# Altium schematic sheet User Control-Sliders.SchDoc
size C
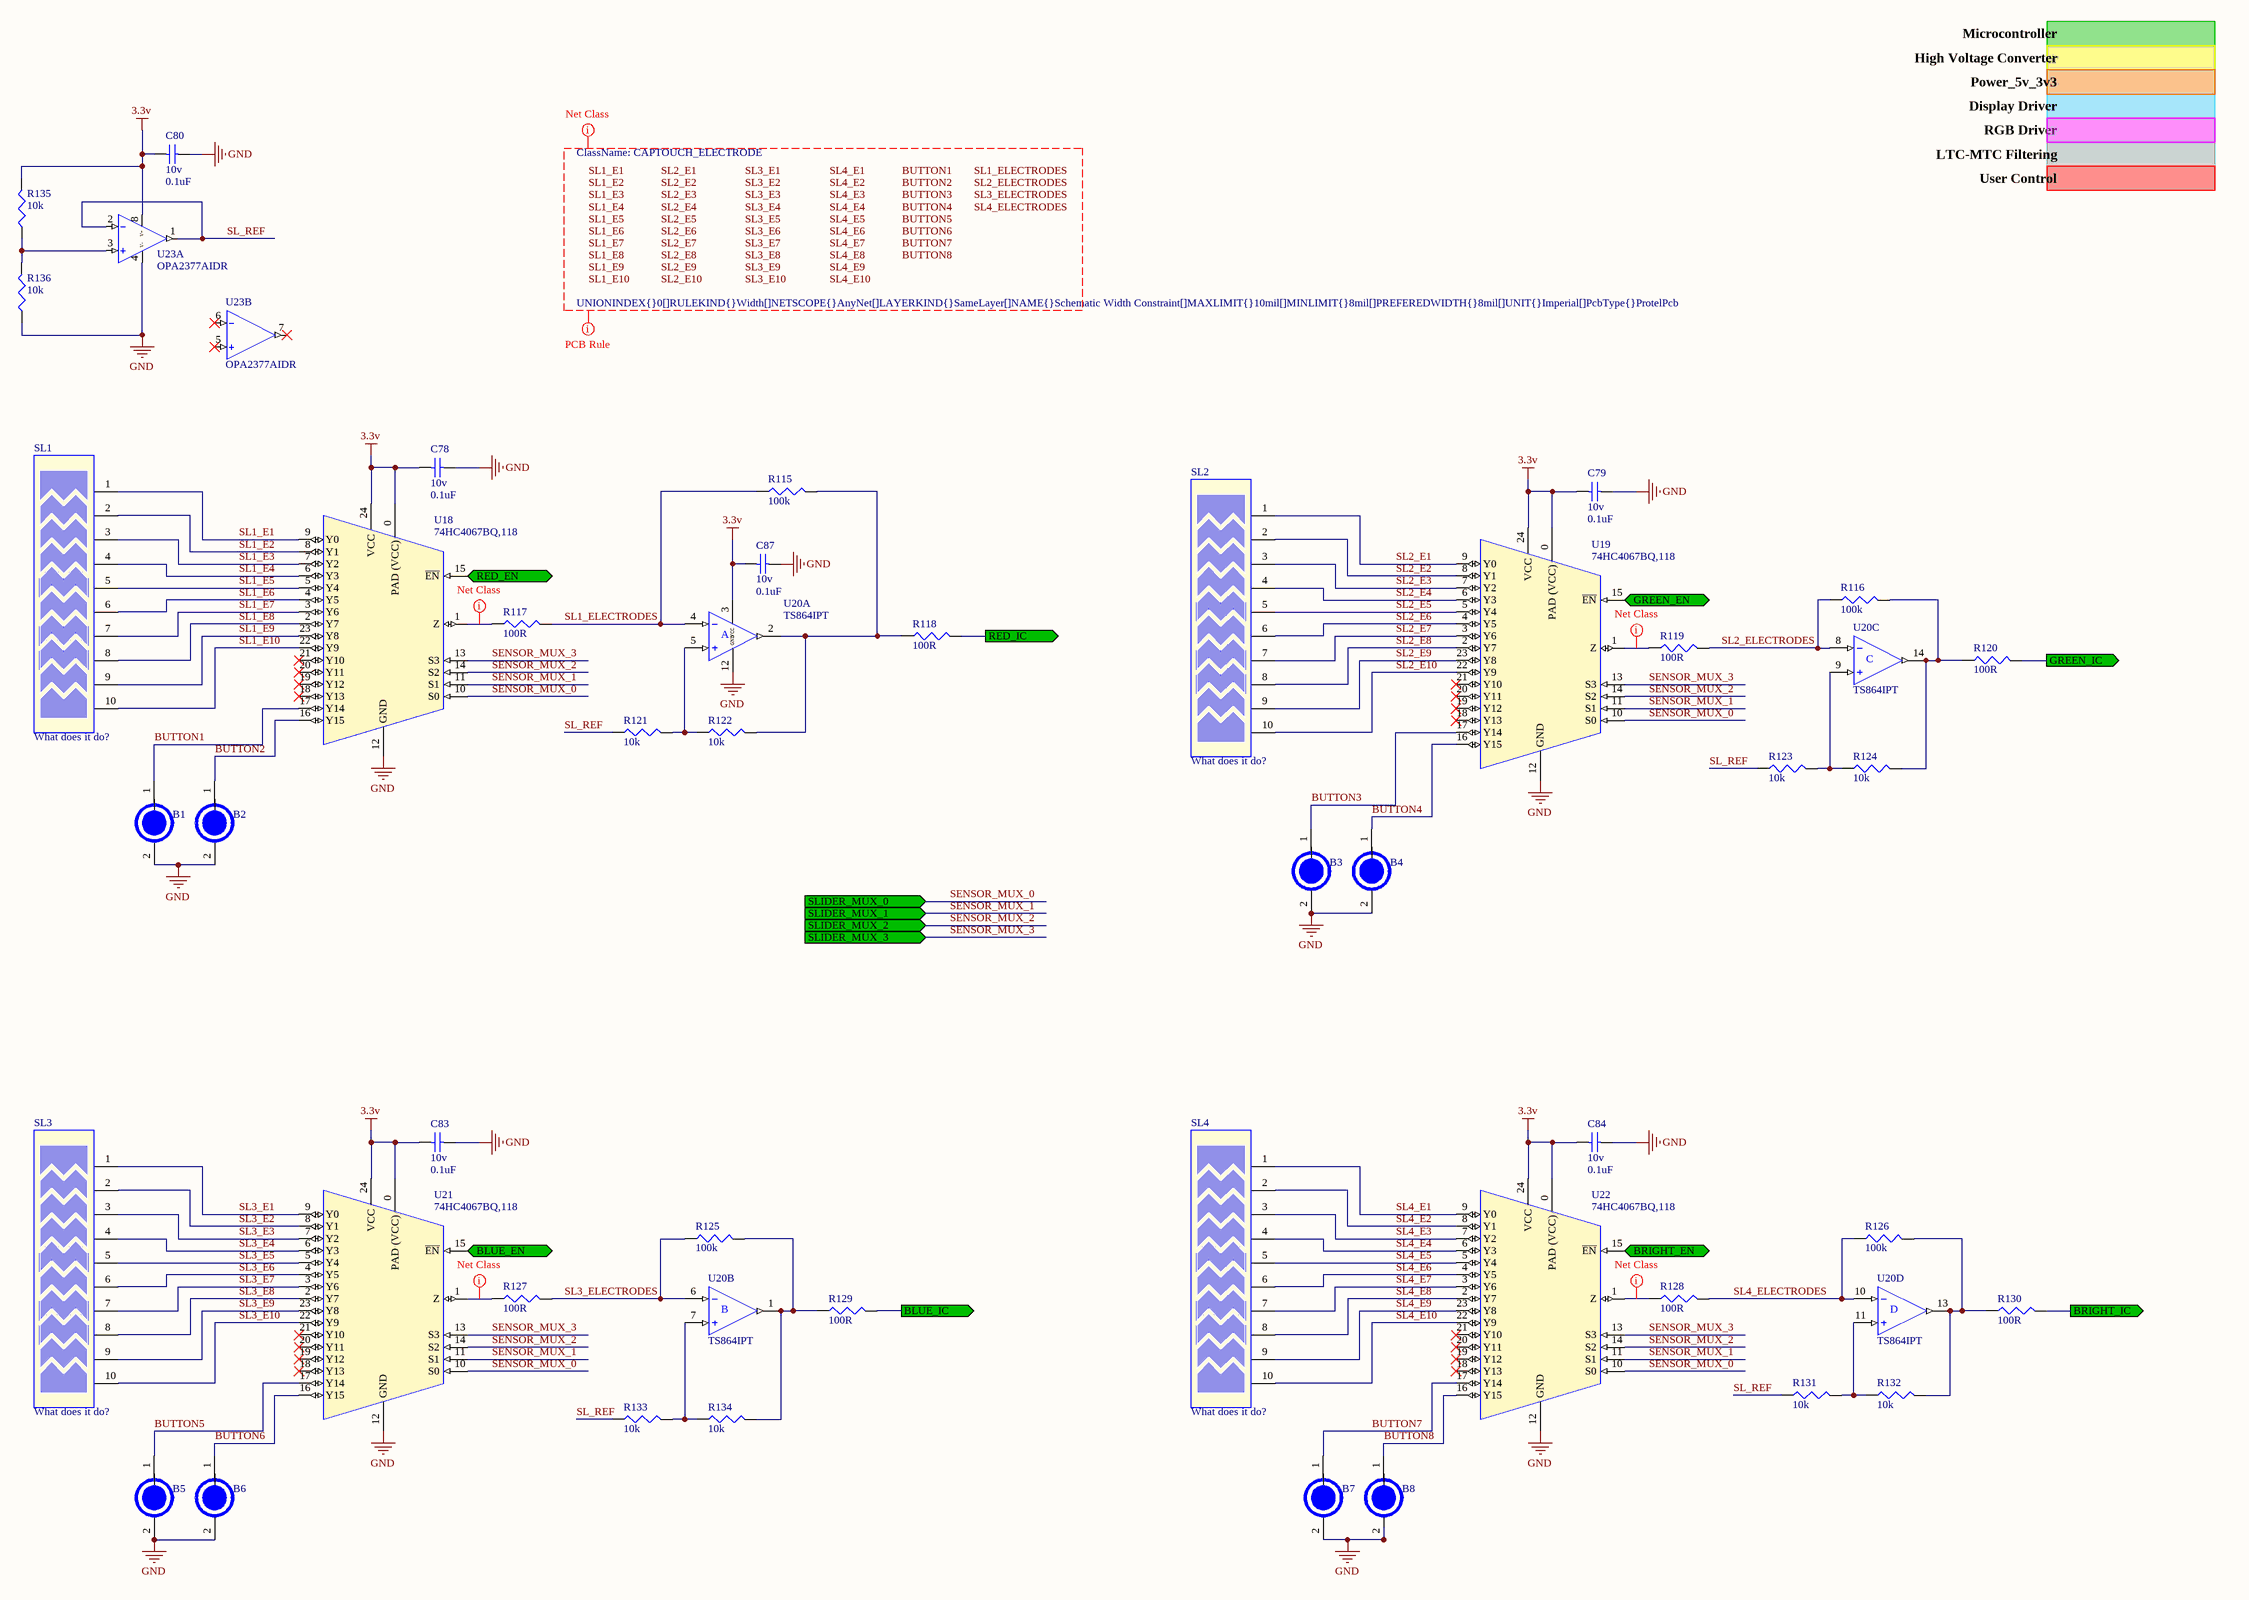
[diagram p0: User Control-Sliders.SchDoc]

## Parts
B1  Cap Touch Button  [Cap Touch Button 10mm]  (value not drawn)  (no BOM)
B2  Cap Touch Button  [Cap Touch Button 10mm]  (value not drawn)  (no BOM)
B3  Cap Touch Button  [Cap Touch Button 10mm]  (value not drawn)  (no BOM)
B4  Cap Touch Button  [Cap Touch Button 10mm]  (value not drawn)  (no BOM)
B5  Cap Touch Button  [Cap Touch Button 10mm]  (value not drawn)  (no BOM)
B6  Cap Touch Button  [Cap Touch Button 10mm]  (value not drawn)  (no BOM)
B7  Cap Touch Button  [Cap Touch Button 10mm]  (value not drawn)  (no BOM)
B8  Cap Touch Button  [Cap Touch Button 10mm]  (value not drawn)  (no BOM)
C78  Voltage: 10v  [CAP0402R]  (hidden comment: 0.1uF)
C79  Voltage: 10v  [CAP0402R]  (hidden comment: 0.1uF)
C80  Voltage: 10v  [CAP0402R]  (hidden comment: 0.1uF)
C83  Voltage: 10v  [CAP0402R]  (hidden comment: 0.1uF)
C84  Voltage: 10v  [CAP0402R]  (hidden comment: 0.1uF)
C87  Voltage: 10v  [CAP0402R]  (hidden comment: 0.1uF)
R115  100k  [RES0402R]
R116  100k  [RES0402R]
R117  100R  [RES0402R]
R118  100R  [RES0402R]
R119  100R  [RES0402R]
R120  100R  [RES0402R]
R121  10k  [RES0402R]
R122  10k  [RES0402R]
R123  10k  [RES0402R]
R124  10k  [RES0402R]
R125  100k  [RES0402R]
R126  100k  [RES0402R]
R127  100R  [RES0402R]
R128  100R  [RES0402R]
R129  100R  [RES0402R]
R130  100R  [RES0402R]
R131  10k  [RES0402R]
R132  10k  [RES0402R]
R133  10k  [RES0402R]
R134  10k  [RES0402R]
R135  10k  [RES0402R]
R136  10k  [RES0402R]
SL1  What does it do?  [Cap Slider 15x55mm]  (no BOM)
SL2  What does it do?  [Cap Slider 15x55mm]  (no BOM)
SL3  What does it do?  [Cap Slider 15x55mm]  (no BOM)
SL4  What does it do?  [Cap Slider 15x55mm]  (no BOM)
U18  74HC4067BQ,118  [SOT815-1]
U19  74HC4067BQ,118  [SOT815-1]
U20  TS864IPT  [TSSOP14]  (parts A,B,C,D of 4)
U21  74HC4067BQ,118  [SOT815-1]
U22  74HC4067BQ,118  [SOT815-1]
U23  OPA2377AIDR  [SOIC-8]  (parts A,B of 2)

## Ports
BLUE_EN (in), BLUE_IC (out), BRIGHT_EN (in), BRIGHT_IC (out), GREEN_EN (in), GREEN_IC (out), RED_EN (in), RED_IC (out), SLIDER_MUX_0 (in), SLIDER_MUX_1 (in), SLIDER_MUX_2 (in), SLIDER_MUX_3 (in)

## Nets
3.3v: C78.1 C79.1 C80.2 C83.1 C84.1 C87.1 R135.2 U18.0(PAD_(VCC)) U18.24(VCC) U19.0(PAD_(VCC)) U19.24(VCC) U20.3(VCC) U21.0(PAD_(VCC)) U21.24(VCC) U22.0(PAD_(VCC)) U22.24(VCC) U23.8(V+)
GND: B1.2(-) B2.2(-) B3.2(-) B4.2(-) B5.2(-) B6.2(-) B7.2(-) B8.2(-) C78.2 C79.2 C80.1 C83.2 C84.2 C87.2 R136.1 U18.12(GND) U19.12(GND) U20.12(GND) U21.12(GND) U22.12(GND) U23.4(V-)
BLUE_EN: U21.15(~{EN}) ; port BLUE_EN
BLUE_IC: R129.2 ; port BLUE_IC
BRIGHT_EN: U22.15(~{EN}) ; port BRIGHT_EN
BRIGHT_IC: R130.2 ; port BRIGHT_IC
BUTTON1: B1.1(+) U18.17(Y14)
BUTTON2: B2.1(+) U18.16(Y15)
BUTTON3: B3.1(+) U19.17(Y14)
BUTTON4: B4.1(+) U19.16(Y15)
BUTTON5: B5.1(+) U21.17(Y14)
BUTTON6: B6.1(+) U21.16(Y15)
BUTTON7: B7.1(+) U22.17(Y14)
BUTTON8: B8.1(+) U22.16(Y15)
GREEN_EN: U19.15(~{EN}) ; port GREEN_EN
GREEN_IC: R120.2 ; port GREEN_IC
RED_EN: U18.15(~{EN}) ; port RED_EN
RED_IC: R118.2 ; port RED_IC
SENSOR_MUX_0: U18.10(S0) U19.10(S0) U21.10(S0) U22.10(S0) ; port SLIDER_MUX_0
SENSOR_MUX_1: U18.11(S1) U19.11(S1) U21.11(S1) U22.11(S1) ; port SLIDER_MUX_1
SENSOR_MUX_2: U18.14(S2) U19.14(S2) U21.14(S2) U22.14(S2) ; port SLIDER_MUX_2
SENSOR_MUX_3: U18.13(S3) U19.13(S3) U21.13(S3) U22.13(S3) ; port SLIDER_MUX_3
SL1_E1: SL1.1 U18.9(Y0)
SL1_E2: SL1.2 U18.8(Y1)
SL1_E3: SL1.3 U18.7(Y2)
SL1_E4: SL1.4 U18.6(Y3)
SL1_E5: SL1.5 U18.5(Y4)
SL1_E6: SL1.6 U18.4(Y5)
SL1_E7: SL1.7 U18.3(Y6)
SL1_E8: SL1.8 U18.2(Y7)
SL1_E9: SL1.9 U18.23(Y8)
SL1_E10: SL1.10 U18.22(Y9)
SL1_ELECTRODES: R115.1 R117.2 U20.4(1IN-)
SL2_E1: SL2.1 U19.9(Y0)
SL2_E2: SL2.2 U19.8(Y1)
SL2_E3: SL2.3 U19.7(Y2)
SL2_E4: SL2.4 U19.6(Y3)
SL2_E5: SL2.5 U19.5(Y4)
SL2_E6: SL2.6 U19.4(Y5)
SL2_E7: SL2.7 U19.3(Y6)
SL2_E8: SL2.8 U19.2(Y7)
SL2_E9: SL2.9 U19.23(Y8)
SL2_E10: SL2.10 U19.22(Y9)
SL2_ELECTRODES: R116.1 R119.2 U20.8(3IN-)
SL3_E1: SL3.1 U21.9(Y0)
SL3_E2: SL3.2 U21.8(Y1)
SL3_E3: SL3.3 U21.7(Y2)
SL3_E4: SL3.4 U21.6(Y3)
SL3_E5: SL3.5 U21.5(Y4)
SL3_E6: SL3.6 U21.4(Y5)
SL3_E7: SL3.7 U21.3(Y6)
SL3_E8: SL3.8 U21.2(Y7)
SL3_E9: SL3.9 U21.23(Y8)
SL3_E10: SL3.10 U21.22(Y9)
SL3_ELECTRODES: R125.1 R127.2 U20.6(2IN-)
SL4_E1: SL4.1 U22.9(Y0)
SL4_E2: SL4.2 U22.8(Y1)
SL4_E3: SL4.3 U22.7(Y2)
SL4_E4: SL4.4 U22.6(Y3)
SL4_E5: SL4.5 U22.5(Y4)
SL4_E6: SL4.6 U22.4(Y5)
SL4_E7: SL4.7 U22.3(Y6)
SL4_E8: SL4.8 U22.2(Y7)
SL4_E9: SL4.9 U22.23(Y8)
SL4_E10: SL4.10 U22.22(Y9)
SL4_ELECTRODES: R126.1 R128.2 U20.10(4IN-)
SL_REF: R121.1 R123.1 R131.1 R133.1 U23.1(OUT_A) U23.2(-IN_A)
NetR115_2: R115.2 R118.1 R122.2 U20.2(1OUT)
NetR116_2: R116.2 R120.1 R124.2 U20.14(3OUT)
NetR117_1: R117.1 U18.1(Z)
NetR119_1: R119.1 U19.1(Z)
NetR121_2: R121.2 R122.1 U20.5(1IN+)
NetR123_2: R123.2 R124.1 U20.9(3IN+)
NetR125_2: R125.2 R129.1 R134.2 U20.1(2OUT)
NetR126_2: R126.2 R130.1 R132.2 U20.13(4OUT)
NetR127_1: R127.1 U21.1(Z)
NetR128_1: R128.1 U22.1(Z)
NetR131_2: R131.2 R132.1 U20.11(4IN+)
NetR133_2: R133.2 R134.1 U20.7(2IN+)
NetR135_1: R135.1 R136.2 U23.3(+IN_A)

Not connected (* = marked no-connect by the designer): U18 18(Y13)* 19(Y12)* 20(Y11)* 21(Y10)*; U19 18(Y13)* 19(Y12)* 20(Y11)* 21(Y10)*; U21 18(Y13)* 19(Y12)* 20(Y11)* 21(Y10)*; U22 18(Y13)* 19(Y12)* 20(Y11)* 21(Y10)*; U23 5(+IN_B)* 6(-IN_B)* 7(OUT_B)*

## Layout directives
net class CAPTOUCH_ELECTRODE: BUTTON1, BUTTON2, BUTTON3, BUTTON4, BUTTON5, BUTTON6, BUTTON7, BUTTON8, NetR117_1, NetR119_1, NetR127_1, NetR128_1, SL1_E1, SL1_E2, SL1_E3, SL1_E4, SL1_E5, SL1_E6, SL1_E7, SL1_E8, SL1_E9, SL1_E10, SL1_ELECTRODES, SL2_E1, SL2_E2, SL2_E3, SL2_E4, SL2_E5, SL2_E6, SL2_E7, SL2_E8, SL2_E9, SL2_E10, SL2_ELECTRODES, SL3_E1, SL3_E2, SL3_E3, SL3_E4, SL3_E5, SL3_E6, SL3_E7, SL3_E8, SL3_E9, SL3_E10, SL3_ELECTRODES, SL4_E1, SL4_E2, SL4_E3, SL4_E4, SL4_E5, SL4_E6, SL4_E7, SL4_E8, SL4_E9, SL4_E10, SL4_ELECTRODES
rule Width Constraint [Pref Width = 8mil    Min Width = 8mil    Max Width = 10mil]: BUTTON1, BUTTON2, BUTTON3, BUTTON4, BUTTON5, BUTTON6, BUTTON7, BUTTON8, SL1_E1, SL1_E2, SL1_E3, SL1_E4, SL1_E5, SL1_E6, SL1_E7, SL1_E8, SL1_E9, SL1_E10, SL1_ELECTRODES, SL2_E1, SL2_E2, SL2_E3, SL2_E4, SL2_E5, SL2_E6, SL2_E7, SL2_E8, SL2_E9, SL2_E10, SL2_ELECTRODES, SL3_E1, SL3_E2, SL3_E3, SL3_E4, SL3_E5, SL3_E6, SL3_E7, SL3_E8, SL3_E9, SL3_E10, SL3_ELECTRODES, SL4_E1, SL4_E2, SL4_E3, SL4_E4, SL4_E5, SL4_E6, SL4_E7, SL4_E8, SL4_E9, SL4_E10, SL4_ELECTRODES

## Notes on the sheet
- Microcontroller
- High Voltage Converter
- Display Driver
- Power_5v_3v3
- RGB Driver
- LTC-MTC Filtering
- User Control
- Labels drawn without touching a wire or pin: BUTTON1, BUTTON2, BUTTON3, BUTTON4, BUTTON5, BUTTON6, BUTTON7, BUTTON8, SL1_E1, SL1_E2, SL1_E3, SL1_E4, SL1_E5, SL1_E6, SL1_E7, SL1_E8, SL1_E9, SL1_E10, SL1_ELECTRODES, SL2_E1, SL2_E2, SL2_E3, SL2_E4, SL2_E5, SL2_E6, SL2_E7, SL2_E8, SL2_E9, SL2_E10, SL2_ELECTRODES, SL3_E1, SL3_E2, SL3_E3, SL3_E4, SL3_E5, SL3_E6, SL3_E7, SL3_E8, SL3_E9, SL3_E10, SL3_ELECTRODES, SL4_E1, SL4_E2, SL4_E3, SL4_E4, SL4_E5, SL4_E6, SL4_E7, SL4_E8, SL4_E9, SL4_E10, SL4_ELECTRODES
- (in symbol TS864IPT, part A) A
- (in symbol TS864IPT, part B) B
- (in symbol TS864IPT, part C) C
- (in symbol TS864IPT, part D) D

## Library data of the parts
B1-B8 = Cap Touch Button 10mm: TYPE: Cap Touch Button; SIZE: 10mm
C78-C80 C83 C84 C87 = 0.1uF 10v (0402): Tolerance: 20%; MFG_PN: VJ0402G104MXQCW1BC; MFG: Vishay; LOAD: NL; Value: 0.1uF
R115 R116 R125 R126 = 100k (0402): Tolerance: 1%; POWER: 63mW; MFG_PN: CRCW0402100KFKED; MFG: Vishay; Load: NL; Value: 100k
R117-R120 R127-R130 = 100R (0402): Tolerance: 1%; POWER: 63mW; MFG_PN: CRCW0402100RFKED; MFG: Vishay; Load: NL; Value: 100R
R121-R124 R131-R136 = 10k (0402): Tolerance: 1%; POWER: 63mW; MFG_PN: CRCW040210K0FKED; MFG: Vishay; Load: NL; Value: 10k
SL1-SL4 = Capacitive Slider 10-position 15x55mm: Middle Capacitance: 10.6pF; End Capacitance: 26.6pF; FUNCTION: What does it do?
U18 U19 U21 U22 = 74HC4067BQ,118: Analog MUX/DEMUX, 16-Channel, 42ns; MFG: NXP; RES: 130; INPUT_CAPACITANCE: 3.5pF; MFG_PN: 74HC4067BQ,118
U20 = TS864IPT: Compartor, Quad, 2.7-10v, 20ns; MFG: ST; CHANNELS: 4; VMAX: 10v; VMIN: 2.7v; OUTPUT: PUSH-PULL; MFG_PN: TS864IPT; RISE: 20ns
U23 = OPA2377AIDR: OpAmp - 2 Channel; LOAD: NL; MFG: TI; CHANNELS: 2; GBP: 5MHz; SINGLE_SUPPLY: TRUE; VMAX: 5.5v; OFFSET_VOLTAGE: 1mV; MFG_PN: OPA2377AIDR